# Altium schematic sheet Row Drivers.SchDoc
size B
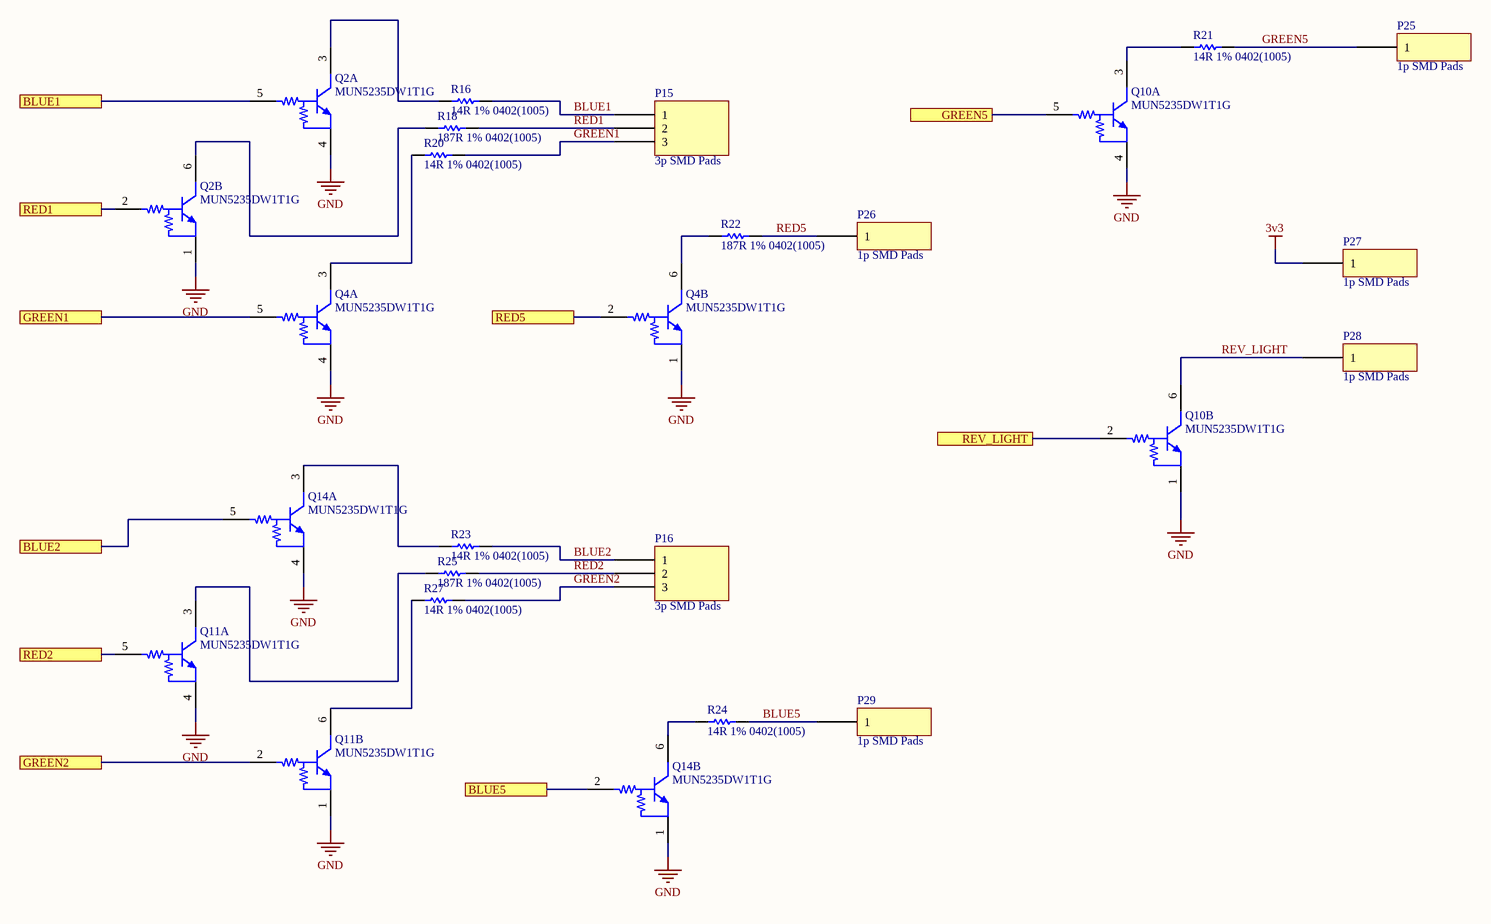
[diagram p0: Row Drivers.SchDoc]

## Parts
P15  3p SMD Pads  [3p SMD pad]
P16  3p SMD Pads  [3p SMD pad]
P25  1p SMD Pads  [1p SMD pad]
P26  1p SMD Pads  [1p SMD pad]
P27  1p SMD Pads  [1p SMD pad]
P28  1p SMD Pads  [1p SMD pad]
P29  1p SMD Pads  [1p SMD pad]
Q2  MUN5235DW1T1G  [ONSC-SOT-363-6-419B-02_V]  (parts A,B of 2)
Q4  MUN5235DW1T1G  [ONSC-SOT-363-6-419B-02_V]  (parts A,B of 2)
Q10  MUN5235DW1T1G  [ONSC-SOT-363-6-419B-02_V]  (parts A,B of 2)
Q11  MUN5235DW1T1G  [ONSC-SOT-363-6-419B-02_V]  (parts A,B of 2)
Q14  MUN5235DW1T1G  [ONSC-SOT-363-6-419B-02_V]  (parts A,B of 2)
R16  14R 1% 0402(1005)  [RESC0402(1005)_N]
R18  187R 1% 0402(1005)  [RESC0402(1005)_N]
R20  14R 1% 0402(1005)  [RESC0402(1005)_N]
R21  14R 1% 0402(1005)  [RESC0402(1005)_N]
R22  187R 1% 0402(1005)  [RESC0402(1005)_N]
R23  14R 1% 0402(1005)  [RESC0402(1005)_N]
R24  14R 1% 0402(1005)  [RESC0402(1005)_N]
R25  187R 1% 0402(1005)  [RESC0402(1005)_N]
R27  14R 1% 0402(1005)  [RESC0402(1005)_N]

## Ports
BLUE1, BLUE2, BLUE5, GREEN1, GREEN2, GREEN5, RED1, RED2, RED5, REV_LIGHT

## Nets
3v3: P27.1
GND: Q2.1(E) Q2.4(E) Q4.1(E) Q4.4(E) Q10.1(E) Q10.4(E) Q11.1(E) Q11.4(E) Q14.1(E) Q14.4(E)
BLUE1: P15.1 R16.2
BLUE1: Q2.5(B) ; port BLUE1  [a separate net that carries the same name]
BLUE2: P16.1 R23.2
BLUE2: Q14.5(B) ; port BLUE2  [a separate net that carries the same name]
BLUE5: Q14.2(B) ; port BLUE5
BLUE5: P29.1 R24.2  [a separate net that carries the same name]
GREEN1: P15.3 R20.2
GREEN1: Q4.5(B) ; port GREEN1  [a separate net that carries the same name]
GREEN2: P16.3 R27.2
GREEN2: Q11.2(B) ; port GREEN2  [a separate net that carries the same name]
GREEN5: Q10.5(B) ; port GREEN5
GREEN5: P25.1 R21.2  [a separate net that carries the same name]
RED1: P15.2 R18.2
RED1: Q2.2(B) ; port RED1  [a separate net that carries the same name]
RED2: P16.2 R25.2
RED2: Q11.5(B) ; port RED2  [a separate net that carries the same name]
RED5: Q4.2(B) ; port RED5
RED5: P26.1 R22.2  [a separate net that carries the same name]
REV_LIGHT: Q10.2(B) ; port REV_LIGHT
REV_LIGHT: P28.1 Q10.6(C)  [a separate net that carries the same name]
NetQ2_3: Q2.3(C) R16.1
NetQ2_6: Q2.6(C) R18.1
NetQ4_3: Q4.3(C) R20.1
NetQ4_6: Q4.6(C) R22.1
NetQ10_3: Q10.3(C) R21.1
NetQ11_3: Q11.3(C) R25.1
NetQ11_6: Q11.6(C) R27.1
NetQ14_3: Q14.3(C) R23.1
NetQ14_6: Q14.6(C) R24.1

## Notes on the sheet
- Title
- Size:
- Date:
- Letter
- Number:
- Time:
- Revision:
- Sheet
- of
- Copyright 2019
- Specialized Solutions LLC
- 206 W Lincoln Hwy STE B
- New Haven, IN 46774
- www.specsolns.com <http://www.specsolns.com>
- File:

## Library data of the parts
P15 P16 = 3p SMD
P25-P29 = 1p SMD
Q2 Q4 Q10 Q11 Q14 = CMP-0630-00303-1: Dual NPN Bias Resistor Transistors, R1=2.2 kOhm, R2=47 kOhm, NPN Transistors, 6-Pin SOT-363, Pb-Free, Tape and Reel; Manufacturer: On Semiconductor; V(BR)CEO Min (V): 50; hFE Min: 80; IC Continuous (A): 0.1; R1/R2 Typ: 0.047; Packing: Tape and Reel; ComponentLink1URL: http://www.onsemi.com/; Mounting Technology: Surface Mount; ComponentLink1Description: Manufacturer URL; ComponentLink3Description: Package Specification; PackageVersion: Rev. Y, 12/2012; RoHS: TRUE; PackageDescription: 6-Pin Small Outline Transistor, Body 2 x 1.25 mm, Pitch 0.65 mm; PackageReference: SOT-363-6-419B-02; ComponentLink3URL: http://www.onsemi.cn/pub_link/Collateral/419B-02.PDF; DatasheetVersion: Rev. 0; ComponentLink2URL: http://www.onsemi.cn/pub_link/Collateral/DTC123JD-D.PDF; PartNumber: MUN5235DW1T1G; Polarity: Dual NPN; ComponentLink2Description: Datasheet; PartId: 1
R16 R20 R21 R23 R24 R27 = CMP-1011-00299-1: 14R 0.063W 1% 0402 (1005 Metric)  SMD; Value: 14.00 Ohm; Case-EIA: 0402; Case-Metric: 1005; Technology: SMT; Tolerance: 1 %; Power: 0.063 W
R18 R22 R25 = CMP-1011-00426-1: 187R 0.063W 1% 0402 (1005 Metric)  SMD; Case-EIA: 0402; Value: 187.00 Ohm; Case-Metric: 1005; Technology: SMT; Tolerance: 1 %; Power: 0.063 W